# Altium project BusinessCardPCB.PrjPcb
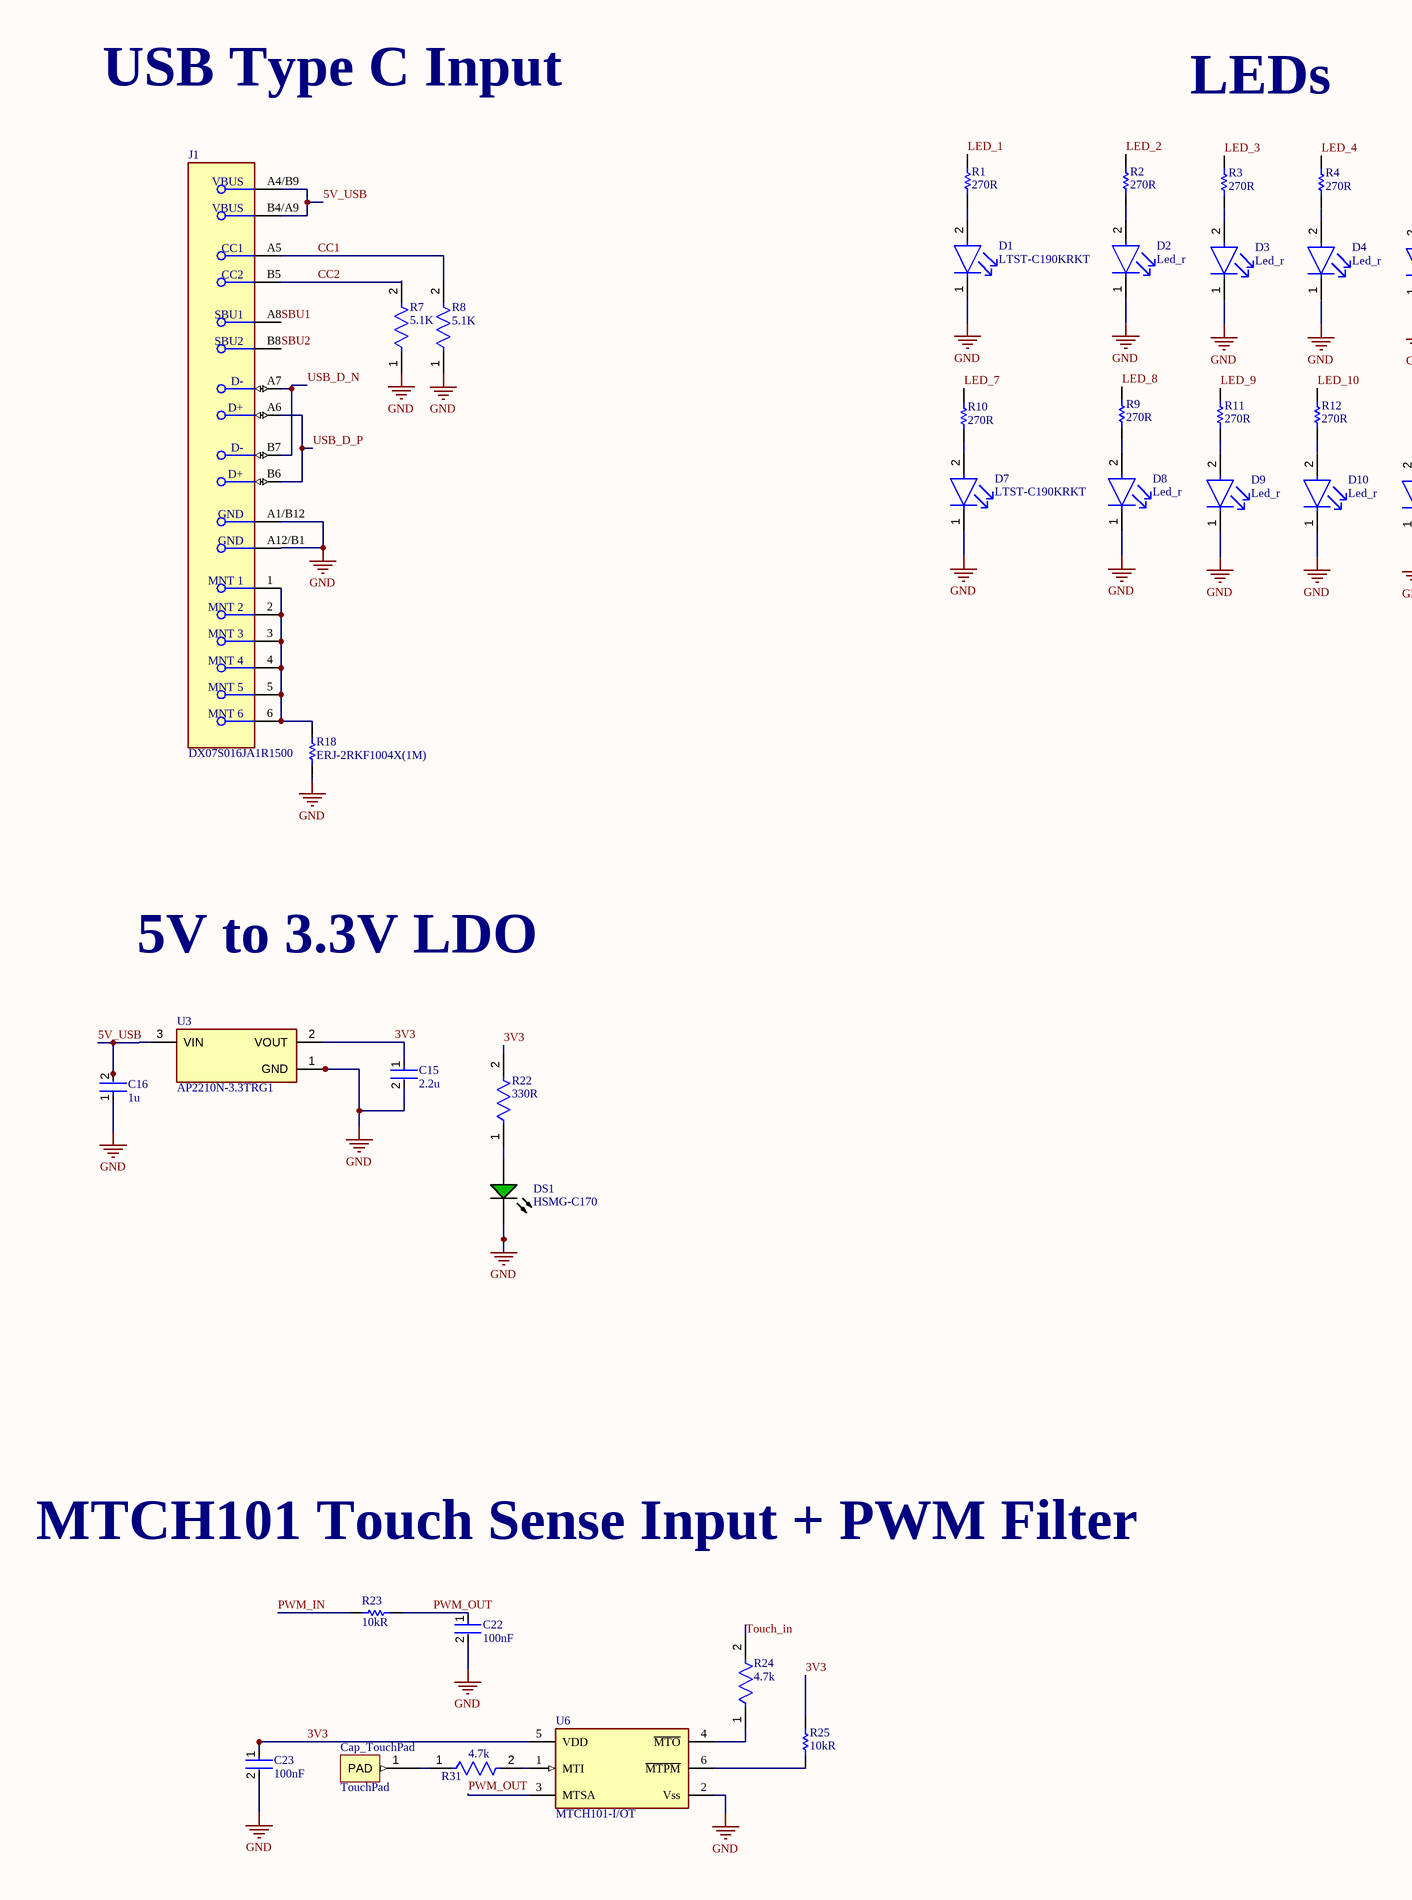
[diagram p0: PCB_Rev1.SchDoc, left]
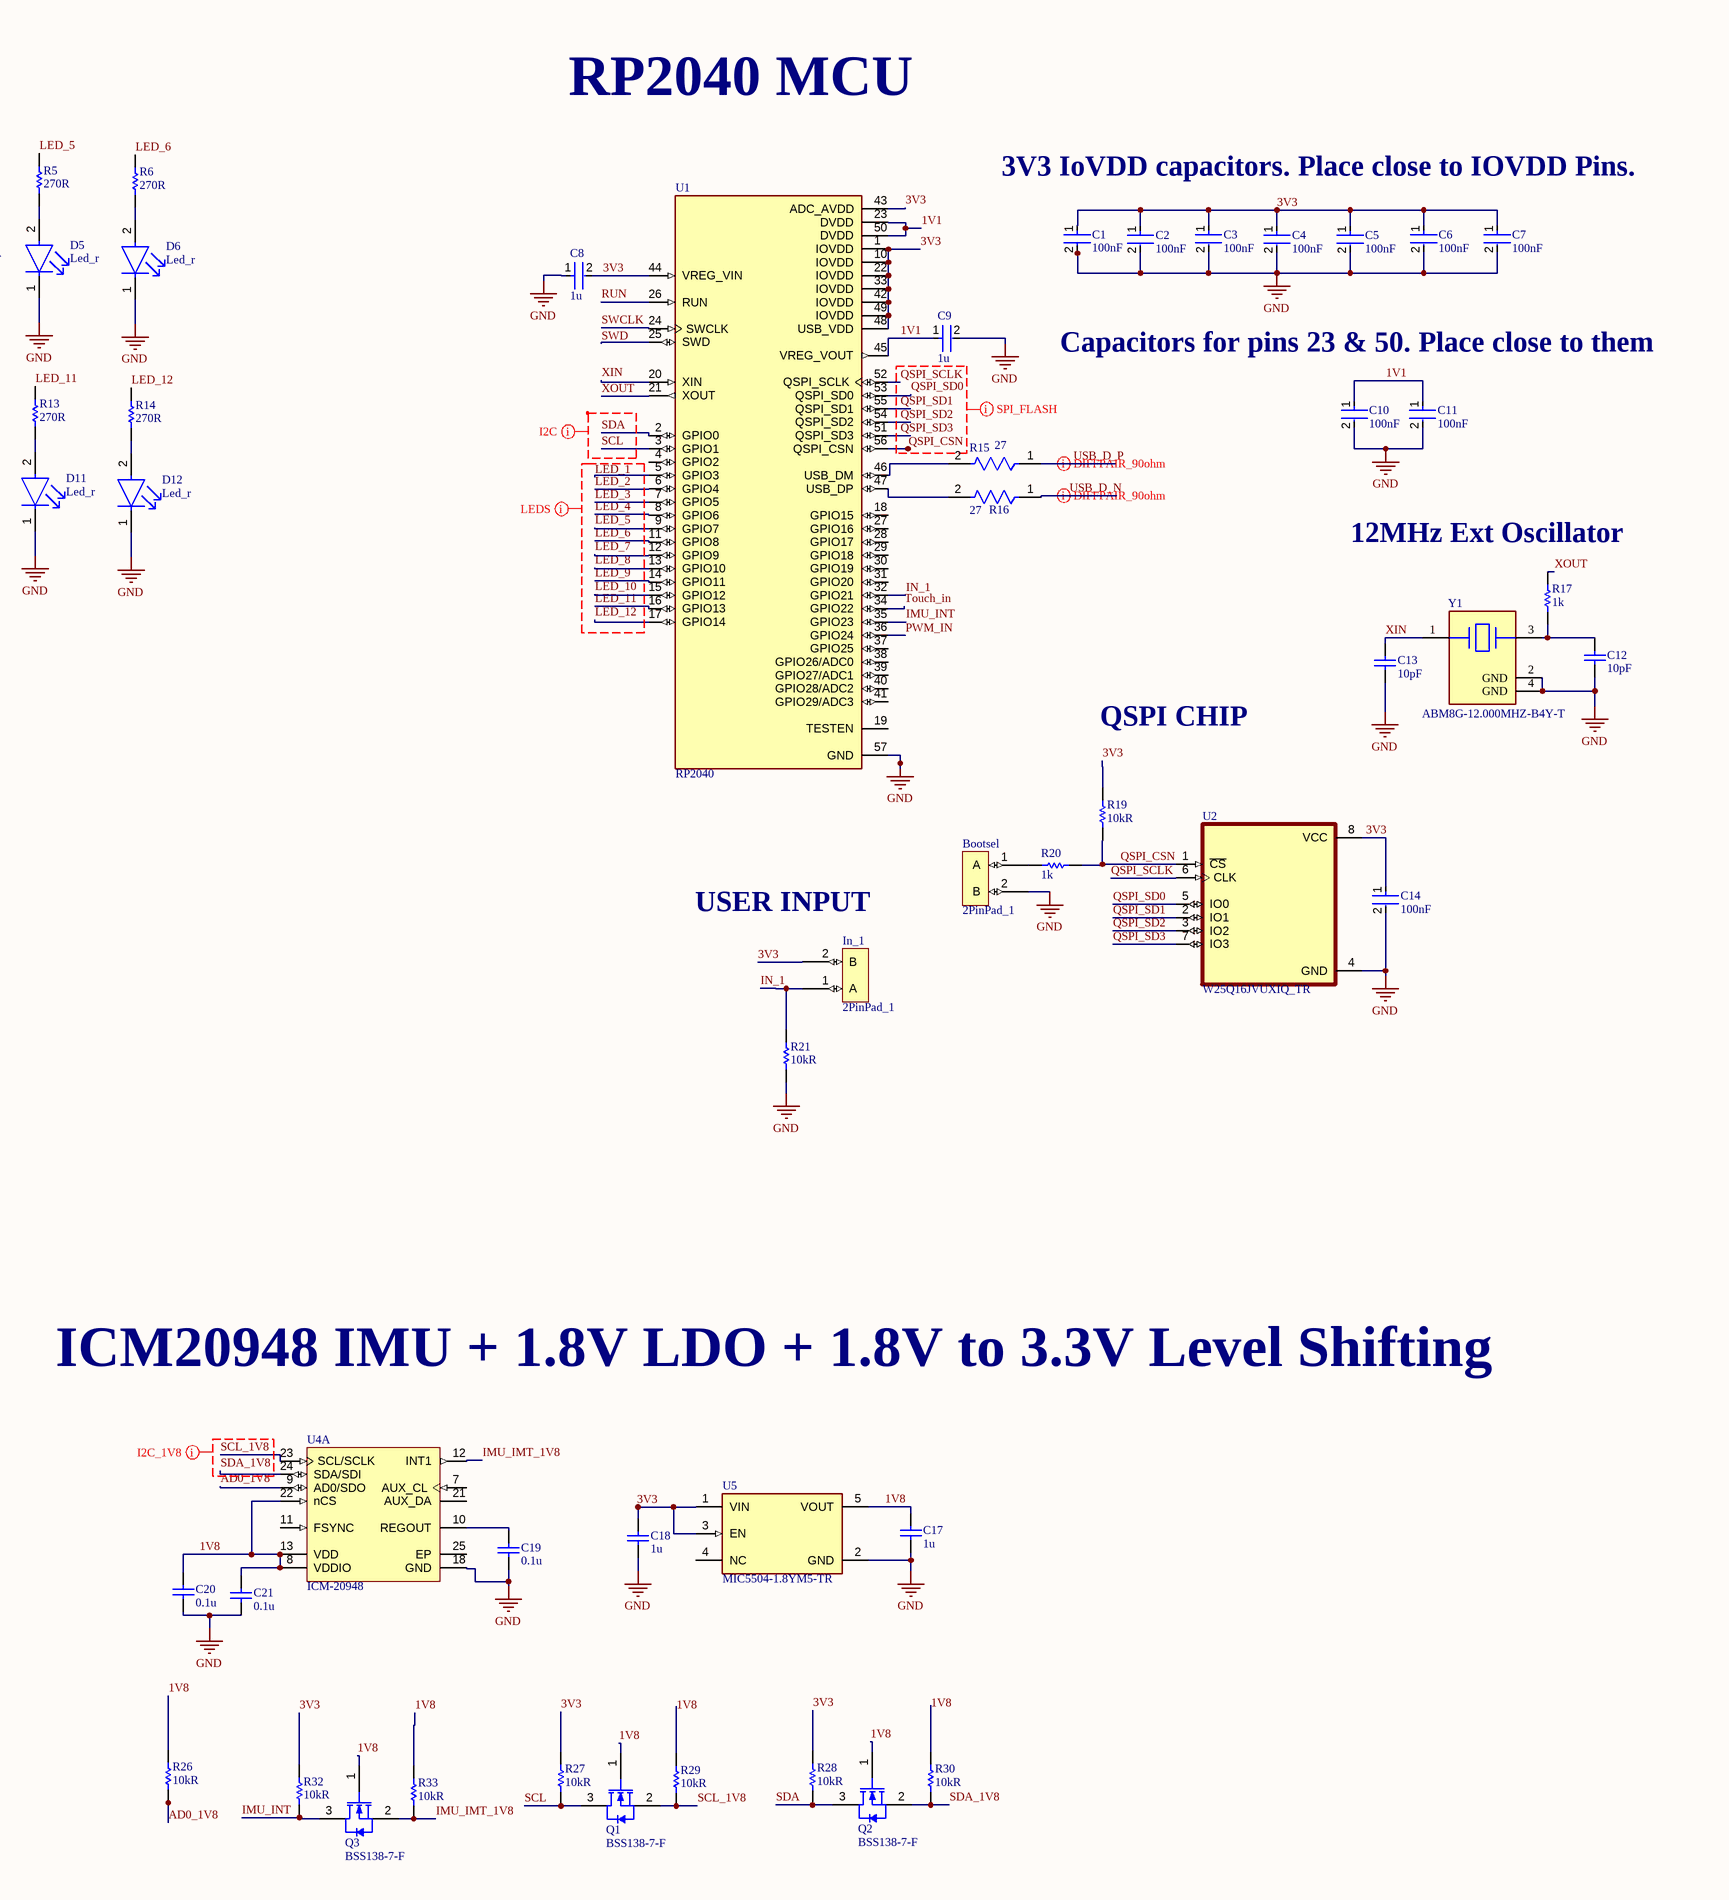
[diagram p1: PCB_Rev1.SchDoc, right]
1 sheet, 83 parts. Net scope: global (net labels, ports and power ports of the same name join across sheets).
Board file: PCB_Rev1.PcbDoc

## Sheet PCB_Rev1.SchDoc: PCB Business Card Schematic
size 594 x 420 mm; Date: June 18th 2023; ApprovedBy: -; CheckedBy: -; Author: Nischay Joshi; CompanyName: -; DrawnBy: Nischay J.; Engineer: -; Organization: -; Revision: 1.0; SheetNumber: 1; SheetTotal: 1; ENG_APP_DATE: -; DSN_APP_DATE: -; CHK_APP_DATE: -; Time: 12:00 pm

### Parts
Bootsel  2PinPad_1  [2PinPad_1]
C1  100nF  [FP-C0402-BB-MFG]
C2  100nF  [FP-C0402-BB-MFG]
C3  100nF  [FP-C0402-BB-MFG]
C4  100nF  [FP-C0402-BB-MFG]
C5  100nF  [FP-C0402-BB-MFG]
C6  100nF  [FP-C0402-BB-MFG]
C7  100nF  [FP-C0402-BB-MFG]
C8  1u  [FP-C0402C105K8PACTU-MFG]
C9  1u  [FP-C0402C105K8PACTU-MFG]
C10  100nF  [FP-C0402-BB-MFG]
C11  100nF  [FP-C0402-BB-MFG]
C12  10pF  [CAPC1005X55X25ML05T05]
C13  10pF  [CAPC1005X55X25ML05T05]
C14  100nF  [FP-C0402-BB-MFG]
C15  2.2u  [FP-C0603C225K4PACTU-MFG]
C16  1u  [FP-C0402C105K8PACTU-MFG]
C17  1u  [CAPC2013X140X50LL20T25]
C18  1u  [CAPC2013X140X50LL20T25]
C19  0.1u  [CAPC1005X55X30NL05T10]
C20  0.1u  [CAPC1005X55X30NL05T10]
C21  0.1u  [CAPC1005X55X30NL05T10]
C22  100nF  [FP-0603-L_1_6_0_15-W_0_81-MFG]
C23  100nF  [FP-C0402-BB-MFG]
Cap_TouchPad  TouchPad  [TouchPad]
D1  LTST-C190KRKT  [FP-LTST-C190KRKT-MFG]
D2  Led_r  [FP-LTST-C190KRKT-MFG]
D3  Led_r  [FP-LTST-C190KRKT-MFG]
D4  Led_r  [FP-LTST-C190KRKT-MFG]
D5  Led_r  [FP-LTST-C190KRKT-MFG]
D6  Led_r  [FP-LTST-C190KRKT-MFG]
D7  LTST-C190KRKT  [FP-LTST-C190KRKT-MFG]
D8  Led_r  [FP-LTST-C190KRKT-MFG]
D9  Led_r  [FP-LTST-C190KRKT-MFG]
D10  Led_r  [FP-LTST-C190KRKT-MFG]
D11  Led_r  [FP-LTST-C190KRKT-MFG]
D12  Led_r  [FP-LTST-C190KRKT-MFG]
DS1  HSMG-C170  [AVAG-HSMX-C170_V]
In_1  2PinPad_1  [2PinPad_1]
J1  DX07S016JA1R1500  [FP-DX07S016JA1R1500-MFG]
Q1  BSS138-7-F  [DIOD-SOT23-3_V]
Q2  BSS138-7-F  [DIOD-SOT23-3_V]
Q3  BSS138-7-F  [DIOD-SOT23-3_V]
R1  270R  [RESC1005X40X25NL05T05]
R2  270R  [RESC1005X40X25NL05T05]
R3  270R  [RESC1005X40X25NL05T05]
R4  270R  [RESC1005X40X25NL05T05]
R5  270R  [RESC1005X40X25NL05T05]
R6  270R  [RESC1005X40X25NL05T05]
R7  5.1K  [FP-CRCW0603-e3-IPC_C]
R8  5.1K  [FP-CRCW0603-e3-IPC_C]
R9  270R  [RESC1005X40X25NL05T05]
R10  270R  [RESC1005X40X25NL05T05]
R11  270R  [RESC1005X40X25NL05T05]
R12  270R  [RESC1005X40X25NL05T05]
R13  270R  [RESC1005X40X25NL05T05]
R14  270R  [RESC1005X40X25NL05T05]
R15  27  [FP-ERJ2R-IPC_B]
R16  27  [FP-ERJ2R-IPC_B]
R17  1k  [RESC1005X40X25NL05T05]
R18  ERJ-2RKF1004X(1M)  [RESC1005X40X25LL05T05]
R19  10kR  [RESC1005X40X25ML05T10]
R20  1k  [RESC1005X40X25NL05T05]
R21  10kR  [RESC1005X40X25ML05T10]
R22  330R  [FP-RC1005-IPC_B]
R23  10kR  [RESC1005X40X25ML05T10]
R24  4.7k  [FP-AC0402-MFG]
R25  10kR  [RESC1005X40X25ML05T10]
R26  10kR  [RESC1005X40X25ML05T10]
R27  10kR  [RESC1005X40X25ML05T10]
R28  10kR  [RESC1005X40X25ML05T10]
R29  10kR  [RESC1005X40X25ML05T10]
R30  10kR  [RESC1005X40X25ML05T10]
R31  4.7k  [FP-AC0402-MFG]
R32  10kR  [RESC1005X40X25ML05T10]
R33  10kR  [RESC1005X40X25ML05T10]
U1  RP2040  [QFN40P700X700X90-57N]
U2  W25Q16JVUXIQ_TR  [PSON50P300X200X60-9N]
U3  AP2210N-3.3TRG1  [FP-SOT23-IPC_C]
U4  ICM-20948  [TDK-QFN-24_L]  (part A of 2)
U5  MIC5504-1.8YM5-TR  [FP-SOT23-5LD-PL-1-MFG]
U6  MTCH101-I/OT  [FP-C04-028-MFG]
Y1  ABM8G-12.000MHZ-B4Y-T  [FP-ABM8G-MFG]

### Nets
GND: Bootsel.2(B) C1.2 C2.2 C3.2 C4.2 C5.2 C6.2 C7.2 C8.1 C9.2 C10.2 C11.2 C12.1 C13.1 C14.2 C15.2 C16.1 C17.2 C18.2 C19.1 C20.1 C21.1 C22.2 C23.2 D1.1(C) D2.1(C) D3.1(C) D4.1(C) D5.1(C) D6.1(C) D7.1(C) D8.1(C) D9.1(C) D10.1(C) D11.1(C) D12.1(C) DS1.2(K) R7.1 R8.1 R18.1 R21.1 U1.57(GND) U2.4(GND) U3.1(GND) U4.18(GND) U5.2(GND) U6.2(Vss) Y1.2(GND) Y1.4(GND)
1V1: C9.1 C10.1 C11.1 U1.23(DVDD) U1.45(VREG_VOUT) U1.50(DVDD)
1V8: C17.1 C20.2 C21.2 Q1.1(G) Q2.1(G) Q3.1(G) R26.2 R29.2 R30.2 R33.2 U4.8(VDDIO) U4.13(VDD) U4.22(nCS) U5.5(VOUT)
3V3: C1.1 C2.1 C3.1 C4.1 C5.1 C6.1 C7.1 C8.2 C14.1 C15.1 C18.1 C23.1 In_1.2(B) R19.2 R22.2 R25.2 R27.2 R28.2 R32.2 U1.1(IOVDD) U1.10(IOVDD) U1.22(IOVDD) U1.33(IOVDD) U1.42(IOVDD) U1.43(ADC_AVDD) U1.44(VREG_VIN) U1.48(USB_VDD) U1.49(IOVDD) U2.8(VCC) U3.2(VOUT) U5.1(VIN) U5.3(EN) U6.5(VDD)
5V_USB: C16.2 J1.A4/B9(VBUS) J1.B4/A9(VBUS) U3.3(VIN)
AD0_1V8: R26.1 U4.9(AD0/SDO)
CC1: J1.A5(CC1) R8.2
CC2: J1.B5(CC2) R7.2
IMU_IMT_1V8: Q3.2(S) R33.1 U4.12(INT1)
IMU_INT: Q3.3(D) R32.1 U1.35(GPIO23)
IN_1: In_1.1(A) R21.2 U1.32(GPIO21)
LED_1: R1.2 U1.5(GPIO3)
LED_2: R2.2 U1.6(GPIO4)
LED_3: R3.2 U1.7(GPIO5)
LED_4: R4.2 U1.8(GPIO6)
LED_5: R5.2 U1.9(GPIO7)
LED_6: R6.2 U1.11(GPIO8)
LED_7: R10.2 U1.12(GPIO9)
LED_8: R9.2 U1.13(GPIO10)
LED_9: R11.2 U1.14(GPIO11)
LED_10: R12.2 U1.15(GPIO12)
LED_11: R13.2 U1.16(GPIO13)
LED_12: R14.2 U1.17(GPIO14)
PWM_IN: R23.2 U1.36(GPIO24)
PWM_OUT: C22.1 R23.1 U6.3(MTSA)
QSPI_CSN: R19.1 R20.1 U1.56(QSPI_CSN) U2.1(~{CS})
QSPI_SCLK: U1.52(QSPI_SCLK) U2.6(CLK)
QSPI_SD0: U1.53(QSPI_SD0) U2.5(IO0)
QSPI_SD1: U1.55(QSPI_SD1) U2.2(IO1)
QSPI_SD2: U1.54(QSPI_SD2) U2.3(IO2)
QSPI_SD3: U1.51(QSPI_SD3) U2.7(IO3)
RUN: U1.26(RUN)
SBU1: J1.A8(SBU1)
SBU2: J1.B8(SBU2)
SCL: Q1.3(D) R27.1 U1.3(GPIO1)
SCL_1V8: Q1.2(S) R29.1 U4.23(SCL/SCLK)
SDA: Q2.3(D) R28.1 U1.2(GPIO0)
SDA_1V8: Q2.2(S) R30.1 U4.24(SDA/SDI)
SWCLK: U1.24(SWCLK)
SWD: U1.25(SWD)
Touch_in: R24.2 U1.34(GPIO22)
USB_D_N: J1.A7(D-) J1.B7(D-) R16.1
USB_D_P: J1.A6(D+) J1.B6(D+) R15.1
XIN: C13.2 U1.20(XIN) Y1.1
XOUT: R17.2 U1.21(XOUT)
NetBootsel_1: Bootsel.1(A) R20.2
NetC12_2: C12.2 R17.1 Y1.3
NetC19_2: C19.2 U4.10(REGOUT)
NetCap_TouchPad_1: Cap_TouchPad.1(PAD) R31.1
NetD1_2: D1.2(A) R1.1
NetD2_2: D2.2(A) R2.1
NetD3_2: D3.2(A) R3.1
NetD4_2: D4.2(A) R4.1
NetD5_2: D5.2(A) R5.1
NetD6_2: D6.2(A) R6.1
NetD7_2: D7.2(A) R10.1
NetD8_2: D8.2(A) R9.1
NetD9_2: D9.2(A) R11.1
NetD10_2: D10.2(A) R12.1
NetD11_2: D11.2(A) R13.1
NetD12_2: D12.2(A) R14.1
NetDS1_1: DS1.1(A) R22.1
NetJ1_1: J1.1(MNT_1) J1.2(MNT_2) J1.3(MNT_3) J1.4(MNT_4) J1.5(MNT_5) J1.6(MNT_6) R18.2
NetR15_2: R15.2 U1.46(USB_DM)
NetR16_2: R16.2 U1.47(USB_DP)
NetR24_1: R24.1 U6.4(~{MTO})
NetR25_1: R25.1 U6.6(~{MTPM})
NetR31_2: R31.2 U6.1(MTI)

Not connected (* = marked no-connect by the designer): J1 A1/B12(GND) A12/B1(GND); U1 4(GPIO2) 18(GPIO15) 19(TESTEN) 27(GPIO16) 28(GPIO17) 29(GPIO18) 30(GPIO19) 31(GPIO20) 37(GPIO25) 38(GPIO26/ADC0) 39(GPIO27/ADC1) 40(GPIO28/ADC2) 41(GPIO29/ADC3); U4 7(AUX_CL) 11(FSYNC) 21(AUX_DA) 25(EP); U5 4(NC)

### Layout directives
differential pair; differential pair class 90ohm; net class USB: USB_D_N, USB_D_P
net class SPI_FLASH: QSPI_CSN, QSPI_SCLK, QSPI_SD0, QSPI_SD1, QSPI_SD2, QSPI_SD3
net class I2C: SCL, SDA
net class LEDS: LED_1, LED_2, LED_3, LED_4, LED_5, LED_6, LED_7, LED_8, LED_9, LED_10, LED_11, LED_12
net class I2C_1V8: SCL_1V8, SDA_1V8

### Notes on the sheet
- USB Type C Input
- LEDs
- RP2040 MCU
- 3V3 IoVDD capacitors. Place close to IOVDD Pins.
- Capacitors for pins 23 & 50. Place close to them
- (near R17) 12MHz Ext Oscillator
- QSPI CHIP
- 5V to 3.3V LDO
- (near In_1) USER INPUT
- ICM20948 IMU + 1.8V LDO + 1.8V to 3.3V Level Shifting
- MTCH101 Touch Sense Input + PWM Filter
- DWG NO:
- REV:
- THIS DOCUMENT AND THE DATA DISCLOSED HEREIN OR
- HEREWITH IS THE PROPERTY OF ALTIUM LIMITED AND MAY
- BE FREELY DISTRIBUTED IN WHOLE. NO RIGHTS ARE
- RESERVED OR EXPRESS OR IMPLIED WARANTEE GIVEN.
- REVISION
- DESCRIPTION
- DATE
- APPROVED
- ENG:
- APPROVALS
- PROJECT
- DSN:
- CHK:
- REFERENCE DOCUMENTS
- PROJECT REVISION:
- TITLE
- DOCUMENT REVISION:
- DESIGN ITEM:
- BOM:
- FAB DWG:
- PCB DWG:
- ASSY DWG:
- SCALE:
- A2
- SIZE
- CAGE CODE
- FILE NAME
- DWG NO.
- SHEET
- OF
- REV

### Library data of the parts
C1-C7 C10 C11 C14 C23 = CMP-2008-02108-2: CAP CER 0.1UF 16V X7R 0402; Manufacturer: Kemet; Manufacturer Part Number: C0402C104K4RACTU; Value: 0.10 μF; Tolerance: 0.1; Material: Ceramic; Temperature Coefficient: 15%; Voltage Rating: 16 V; Package: C0402-BB; Automotive: No; Ipc Land Pattern Name: CAPC10050X50; Device Class L3: Ceramic Capacitors; Capacitance: 0.10 μF; Octopart: https://octopart.com/c0402c104k4ractu-kemet-94158; Temperature Characteristic: X7R; Mouser Description: Cap Ceramic 0.1uF 16V X7R 10% SMD 0402 125?C Paper T/R - Tape and Reel (Alt: C0402C104K4RAC TU); ComponentLink2Description: Datasheet; Temperature Range Low: -55°C; RoHS: TRUE; Device Class L1: Passive Components; Temperature Range High: +125°C; Device Class L2: Capacitors; ComponentLink2URL: https://content.kemet.com/datasheets/KEM_C1002_X7R_SMD.pdf; Category: Cap; Height: 0.55mm; Temperature: -55°C to +125°C; Lead Free: Yes; Digikey Description: CAP CER 0.1UF 16V X7R 0402
C8 C9 C16 = CMP-2008-02081-2: CAP CER 1UF 10V X5R 0402; Dielectric Material: Ceramic; Dissipation Factor: 5%; Tolerance: 10%; Number of Pins: 2; Contact Plating: Tin; Min Operating Temperature: -55°C; Termination: SMD/SMT; Lead Free: Lead Free; Construction: Flat; Voltage Rating (DC): 10V; Mount: Surface Mount; Series: C; Thickness: 0.022inch; Width: 0.5mm; Radiation Hardening: No; Capacitance: 1uF; Dielectric: X5R; Height: 0.5mm; Voltage: 10V; Length: 1mm; Depth: 0.5mm; Max Operating Temperature: 85°C; Package Quantity: 1; Packaging: Tape and Reel; RoHS Compliant: Yes; Case Code (Imperial): 0402; Case Code (Metric): 1005; REACH SVHC: No SVHC; Voltage Rating: 10V; Case/Package: 0402
C12 C13 = CMP-2100-03589-1: Chip Capacitor, 10 pF, +/- 5%, 50 V, -55 to 125 degC, 0402 (1005 Metric), RoHS, Tape and Reel; Manufacturer: Yageo; Insulation Resistance: 100GR; Voltage Rating (DC): 50V; Dielectric Material: Ceramic; Temperature Coefficient: 30ppm/degC; Dielectric: C0G; Termination: SMD/SMT; Package Reference: 0402; Lead Free: LeadFree; Composition: Ceramic; Tolerance: 5%; Case Code (Metric): 1005; Voltage Rating: 50V; Packaging: TapeandReel; Manufacturer URL: http://www.yageo.com/; REACH SVHC: NoSVHC; Max Operating Temperature: 125degC; Length: 1mm; Mount: SurfaceMount; Depth: 0.5mm; Min Operating Temperature: -55degC; Number of Pins: 2; Width: 0.02inch; Datasheet Version: Rev. 14, 07/2016; Package Quantity: 1; Datasheet URL: http://www.yageo.com/documents/recent/UPY-GP_NP0_16V-to-50V_14.pdf; Case Code (Imperial): 0402; RoHSCompliant: True; Radiation Hardening: No; Height: 0.5mm; Case/Package: 0402; Thickness: 0.022inch; Capacitance: 10pF; Package Description: 2-Pin Surface Mount Device, Body 1 x 0.5 mm; Voltage: 50V
C15 = CMP-2006-02259-2: CAP CER 2.2UF 16V X5R 0603; Dielectric Material: Ceramic; Tolerance: 10%; Dissipation Factor: 5%; Series: C; Voltage Rating (DC): 16V; REACH SVHC: No SVHC; RoHS Compliant: Yes; Number of Pins: 2; Max Operating Temperature: 85°C; Voltage Rating: 16V; Min Operating Temperature: -55°C; Termination: SMD/SMT; Dielectric: X5R; Packaging: Tape and Reel; Contact Plating: Tin; Case Code (Metric): 1608; Height: 0.8mm; Capacitance: 2.2uF; Case/Package: 0603; Width: 0.8mm; Construction: Flat; Depth: 0.8mm; Thickness: 0.034inch; Radiation Hardening: No; Length: 1.6mm; Mount: Surface Mount; Case Code (Imperial): 0603; Voltage: 16V; Package Quantity: 1; Lead Free: Lead Free
C17 C18 = CMP-1036-04737-2: Manufacturer: Kemet; Part Number: C0805C105J8RACTU
C19-C21 = CMP-2008-03087-1: Manufacturer: Kemet; Part Number: C0402C104K9RACTU
C22 = CMP-2006-02049-2: General Purpose Ceramic Capacitor, 0603, 100nF, 5%, X7R, 15%, 50V; Termination: SMD/SMT; Contact Plating: Tin; Min Operating Temperature: -55°C; Width: 0.032inch; Length: 1.6mm; Case Code (Metric): 1608; REACH SVHC: No SVHC; Thickness: 0.035inch; Voltage Rating: 50V; Packaging: Tape and Reel; Series: -; Number of Pins: 2; Capacitance: 100nF; Dielectric: X7R; RoHS Compliant: Yes; Case Code (Imperial): 0603; Package Quantity: 1; Height: 0.9mm; Depth: 0.81mm; Max Operating Temperature: 125°C; Voltage Rating (DC): 50V; Construction: Flat; Dielectric Material: Ceramic; Lead Free: Lead Free; Mount: Surface Mount; Tolerance: 5%; Case/Package: 0603; Radiation Hardening: No; Voltage: 50V
D1-D12 = CMP-1674-00011-2: LED RED CLEAR CHIP SMD; Reverse Voltage: 5V; Viewing Angle: 130°; Power Rating: 75mW; Test Current: 20mA; Number of Elements: 1; Lens Color: Colorless; Wavelength: 639nm; Dominant Wavelength: 631nm; Lens Style: Diffused; Forward Current: 30mA; Forward Voltage: 2.4V; Luminous Intensity: 54mcd; Color: Red; Case Code (Imperial): 0603; Lens Transparency: Clear; Lead Free: Lead Free; Package Quantity: 1; Packaging: Tape and Reel; Max Operating Temperature: 85°C; Number of Pins: 2; Height: 0.8mm; Case/Package: 0603; Number of LEDs: 1; Width: 0.8mm; Case Code (Metric): 1608; Depth: 0.8mm; Mount: Surface Mount; Radiation Hardening: No; Length: 1.6mm; Illumination Color: Red; Power Dissipation: 75mW; Min Operating Temperature: -55°C
DS1 = CMP-2000-05062-1: Chip LED, Green, 2.2 V, -40 to 85 degC, 2-Pin SMD, Pb-Free, Tape and Reel; Manufacturer: Avago; No. of Pins: 2; Peak Wavelength: 570nm; SVHC: NoSVHC(16-Jun-2014); Dominant Wavelength: 572nm; Forward Current If: 20mA; Viewing Angle: 170deg; Lens Shape: Rectangular; PIV Max: 5V; External Width: 1.25mm; LED Type: Standard; External Depth: 0.8mm; Opto Mounting Orientation: Top; Luminous Intensity: 15mcd; Luminous Intensity Min: 4mcd; Forward Voltage VF Max: 2.6V; External Length / Height: 2mm; Bulb Size: 1.25mmx1.4mm; Light Area Height: 1mm; Voltage Vf Typ: 2.2V; Operating Temperature Max: 85degC; Datasheet Version: Oct-08; MSL: MSL2A-4weeks; Peak Forward Current: 20mA; Package Description: 2-Pin Surface Mount Device, Body 2 x 1.25 mm, Height 0.8 mm; Datasheet URL: https://datasheet.ciiva.com/29280/180495-da-01-en-chip-led-hsmg-c170-gelb-gruen-29280971.pdf; Storage Temperature Min: -40degC; LED Colour: Green; Wavelength Typ: 570nm; Mounting Type: SMD; Forward Current If Max: 20mA; Dominant Wavelength Typ: 572nm; LED Mounting: SMD; Operating Temperature Range: -30degCto+85degC; Operating Temperature Min: -30degC; Manufacturer URL: http://www.avagotech.com/; Packaging: CutTape; Luminous Intensity Typ: 15mcd; Package Reference: HSMX-C170; Storage Temperature Max: 85degC; Opto Case Style: SMD; Forward Voltage: 2.2V
J1 = CMP-19038-000003-1: CONN RCP USB2.0 TYP C 24P SMD RA
Q1-Q3 = CMP-2000-04930-1: N-Channel Enhancement Mode Mosfet, 50 V, 0.2 A, -55 to 150 degC, 3-Pin SOT23, RoHS, Tape and Reel; Manufacturer: Diodes Inc; Brand: DiodesIncorporated; Unit Weight: 0.000282oz; Pd - Power Dissipation: 300mW; Id - Continuous Drain Current: 200mA; Rds On - Drain-Source Resistance: 3.5Ohms; Vgs - Gate-Source Voltage: 20V; Number of Channels: 1Channel; Vds - Drain-Source Breakdown Voltage: 50V; Transistor Type: 1N-Channel; Typical Turn-Off Delay Time: 20ns; Configuration: Single; Mounting Style: SMD/SMT; Height: 1mm; Package Description: 3-Pin Small Outline Transistor, Body 2.9 x 1.3 mm, Pitch 0.96 mm; Datasheet Version: Rev. 20-2, 11/2013; Minimum Operating Temperature: -55C; Package / Case: SOT-23-3; Channel Mode: Enhancement; Product: MOSFETSmallSignal; Packaging: Reel; Maximum Operating Temperature: +150C; Datasheet URL: https://datasheet.ciiva.com/8115/ds30144-8115344.pdf; Product Category: MOSFET; Width: 1.3mm; Technology: Si; Package Reference: SOT23-3; Manufacturer URL: http://www.diodes.com/; Transistor Polarity: N-Channel; Length: 2.9mm; Factory Pack Quantity: 3000; Series: BSS138; RoHS: True; Typical Turn-On Delay Time: 20ns
R1-R6 R9-R14 = CMP-1011-00444-2: Part Number: ERJ2RKF2700X; Manufacturer: Panasonic
R7 R8 = CMP-1012-00590-3: RES Thick Film, 5.1kΩ, 1%, 0.1W, 100ppm/°C, 0603; Power Rating: 100mW; Voltage Rating (DC): 75V; Resistance: 5.1kR; Width: 0.85mm; Depth: 0.85mm; Military Standard: Not; Package Quantity: 5000; Case Code (Metric): 1608; Length: 1.55mm; Weight: 7.1E-05oz; Packaging: Tape and Reel; Temperature Coefficient: 100ppm/°C; Case Code (Imperial): 0603; Lead Free: Lead Free; Radiation Hardening: No; Contact Plating: Tin; Composition: Thick Film; Max Operating Temperature: 155°C; Termination: SMD/SMT; Case/Package: 0603; Min Operating Temperature: -55°C; Tolerance: 1%; Voltage Rating: 75V; Mount: Surface Mount; Height: 0.45mm
R15 R16 = CMP-2002-00830-2: RES SMD 27 OHM 1% 1/10W 0402; Voltage Rating: 50V; Temperature Coefficient: 100ppm/°C; Resistance: 27R; Power Rating: 100mW; Military Standard: Not; Construction: Rectangular; Tolerance: 1%; Features: Automotive AEC-Q200; Length: 1mm; Lead Free: Lead Free; Mount: Surface Mount; Number of Terminations: 2; Radiation Hardening: No; Number of Pins: 2; Width: 0.5mm; Contact Plating: Tin; Voltage Rating (DC): 50V; Resistance Tolerance: 1%; Series: ERJ; Packaging: Tape and Reel; Case/Package: 0402; Technology: THICK FILM; REACH SVHC: No SVHC; Depth: 0.5mm; Resistor Type: Thick Film; Package Quantity: 1; Termination: SMD/SMT; Case Code (Imperial): 0402; Height: 0.35mm; Weight: 2.8E-05oz; Max Operating Temperature: 155°C; Case Code (Metric): 1005; Min Operating Temperature: -55°C; RoHS Compliant: Yes; Max Power Dissipation: 100mW
R17 R20 = CMP-1011-00510-4: Chip Resistor, 1 KOhm, +/- 1%, 100 mW, -55 to 155 degC, 0402 (1005 Metric), RoHS, Tape and Reel; PartNumber: ERJ-2RKF1001X; Manufacturer: Basic Passives; Voltage Rating: 50 V; Case\/Package: 0402; Resistance: 1 KOhm; Power Rating: 100 mW; DatasheetVersion: 04/2015; Radiation Hardening: No; Pins: 2; Height: 0.35 mm; RoHSCompliant: true; Case Code (Imperial): 0402; ComponentLink2Description: Datasheet; ComponentLink1Description: Manufacturer URL; PackageReference: 0402; Mount: Surface Mount; Package Quantity: 10000; Tolerance: 1%; ComponentLink1URL: http://www.panasonic.com/; PackageDescription: 2-Pin Surface Mount Device, Body 1 x 0.5 mm; Mounting Technology: Surface Mount; Case Code (Metric): 1005; ComponentLink2URL: http://industrial.panasonic.com/cdbs/www-data/pdf/RDA0000/AOA0000C86.pdf; REACH SVHC: Yes; Packaging: Tape and Reel; Max Operating Temperature: 155 degC; Min Operating Temperature: -55 degC; Width: 0.5 mm; Length: 1 mm
R18 = CMP-2002-00609-3: Chip Resistor, 1 MOhm, +/- 1%, 100 mW, -55 to 155 degC, 0402 (1005 Metric), RoHS, Tape and Reel; Manufacturer: Basic Passives; Voltage Rating: 50 V; Case\/Package: 0402; Resistance: 1 MOhm; Power Rating: 100 mW; Pins: 2; Max Operating Temperature: 155 degC; ComponentLink2URL: http://industrial.panasonic.com/cdbs/www-data/pdf/RDA0000/AOA0000C86.pdf; Weight: 2.8E-05oz; ComponentLink1URL: http://www.panasonic.com/; Radiation Hardening: No; Height: 0.35 mm; Case Code (Imperial): 0402; ComponentLink2Description: Datasheet; Mount: Surface Mount; ComponentLink1Description: Manufacturer URL; REACH SVHC: Yes; PartNumber: ERJ-2RKF1004X; Length: 1 mm; Min Operating Temperature: -55 degC; Width: 0.5 mm; Package Quantity: 10000; Tolerance: 1%; PackageDescription: 2-Pin Surface Mount Device, Body 1 x 0.5 mm; RoHSCompliant: true; DatasheetVersion: 04/2015; PackageReference: 0402; Mounting Technology: Surface Mount; Case Code (Metric): 1005; Packaging: Tape and Reel
R19 R21 R23 R25-R30 R32 R33 = CMP-2002-03043-1: Part Number: CRCW040210K0FKEDHP; Manufacturer: Vishay Dale
R22 = CMP-13261-004965-1: Res Thick Film 0402 330Ω 1% 0.063W ±100ppm/°C Molded SMD T/R; Max Power Dissipation: 63mW; Contact Plating: Tin; Case/Package: 0402; Width: 0.02inch; Min Operating Temperature: -55°C; Composition: Thick Film; Package Quantity: 1; Length: 0.039inch; Case Code (Imperial): 0402; Case Code (Metric): 1005; Height: 0.016inch; Features: Moisture Resistant; Resistance: 330R; Radiation Hardening: No; Military Standard: Not; Depth: 0.5mm; Temperature Coefficient: 100ppm/°C; Max Operating Temperature: 155°C; Packaging: Tape and Reel; Tolerance: 1%; Number of Terminations: 2; Power Rating: 63mW
R24 R31 = CMP-2002-01824-3: RES 4.7kΩ ±1% 0.063W 0402; Power Rating: 62.5mW; Resistance: 4.7kR; Max Power Dissipation: 63mW; Voltage Rating: 50V; Temperature Coefficient: 100ppm/°C; Max Operating Temperature: 155°C; Tolerance: 1%; Series: AC; Size Code: 0402; Case Code (Metric): 1005; Termination: SMD/SMT; Packaging: Tape and Reel; Min Operating Temperature: -55°C; RoHS Compliant: Yes; Features: Moisture Resistant; Length: 0.039inch; Width: 0.5mm; Weight: 2.3E-05oz; Lead Free: Lead Free; Resistor Type: Thick Film; Case Code (Imperial): 0402; Height: 0.015inch; Case/Package: 0402; Number of Terminations: 2
U1 = RP2040: MF: {'manufacturer': u'Raspberry Pi'}; Package: None; Price: None; Value: *; MP: RP2040; Availability: Unavailable
U2 = W25Q16JVUXIQ_TR: MF: {'manufacturer': u'Winbond'}; MP: W25Q16JVUXIQ TR; Package: None; Price: None; Value: *; Availability: Unavailable
U3 = CMP-12756-000036-1: IC REG LINEAR 3.3V 300MA SOT23-3; Accuracy: 1%; Max Input Voltage: 13.2V; Number of Outputs: 1; Polarity: Positive; Power Supply Rejection Ratio (PSRR): 75dB; Quiescent Current: 150uA; Min Input Voltage: 2.5V; Output Type: Fixed; Dropout Voltage: 250mV; Height: 1.3mm; Weight: 0.000282oz; Packaging: Tape and Reel; Length: 3.02mm; Width: 1.7mm; Max Operating Temperature: 125°C; Output Voltage: 3.3V; Min Operating Temperature: -40°C; Output Current: 300mA; Number of Pins: 3; Number of Regulators: 1; Max Output Current: 300mA; Mount: Surface Mount; Case/Package: SOT-23-3; Package Quantity: 3000
U4 = CMP-2000-07532-1: World’s Lowest Power 9-Axis MEMS MotionTracking(TM) Device, 1.71 to 3.6 V, -40 to 85 degC, 24-Pin QFN, RoHS, Tape and Reel; Manufacturer: TDK; Package Description: 24-Pin Quad Flat No-lead Package, Body 3 x 3 mm, Pitch 0.4 mm; Datasheet Version: Rev. 1.3, 06/2017; Package Reference: QFN-24; Mounting Technology: SurfaceMount; Datasheet URL: https://www.invensense.com/wp-content/uploads/2016/06/DS-000189-ICM-20948-v1.3.pdf; Manufacturer URL: http://www.tdk.com/
U5 = CMP-06324-000021-1: IC REG LINEAR 1.8V 300MA SOT23-5; Manufacturer: Microchip; Dropout Voltage: 160mV; Number Of Outputs: 1; Nominal Supply Current: 38-42uA; Accuracy Percentage: 2%; Max Supply Voltage: 5.5V; Max Junction Temp: +125°C; Min Supply Voltage: 2.5V; Standoff Height: 0mm; Output Type: Fixed; Temperature Range Low: -40°C; Temperature Range High: +125°C; Automotive: No; Octopart: https://octopart.com/mic5504-1.8ym5-tr-microchip-66803399; RoHS: TRUE; Device Class L1: Integrated Circuits (ICs); Device Class L3: Voltage Regulators - Linear; Package: SOT23-5LD-PL-1; Device Class L2: Power Management ICs; Output Current: 300mA; Digikey Description: IC REG LINEAR 1.8V 300MA SOT23-5; Lead Free: Yes; Output Voltage: 1.8V; Height: 1.45mm; Category: IC; ComponentLink2Description: Datasheet; Temperature: -40°C to +125°C; ComponentLink2URL: http://ww1.microchip.com/downloads/en/DeviceDoc/MIC5501-02-03-04-300mA-Single-Output-LDO-in-Small-Packages-DS20006006B.pdf; Manufacturer Part Number: MIC5504-1.8YM5-TR
U6 = CMP-06354-000003-1: IC PROXIMITY DETECTOR SOT23-6; Nominal Supply Current: 120uA; Min Supply Voltage: 2V; Sensing Method: Capacitive; Output Configuration: Digital; Operating Supply Current: 340uA; Max Supply Current: 25mA; Max Supply Voltage: 5.5V; Number of Pins: 6; Packaging: Bulk; Package Quantity: 3000; Min Operating Temperature: -40°C; Width: 1.8mm; Mount: Surface Mount; Max Operating Temperature: 85°C; Supply Current: 120uA; REACH SVHC: No SVHC; Height: 1.3mm; Length: 3.1mm; Case/Package: SOT-23; Series: -; RoHS Compliant: Yes; Max Output Current: 25mA; Radiation Hardening: No
Y1 = CMP-27762-015546-1: Crystal 12MHz ±30ppm (Tol) ±30ppm (Stability) 10pF FUND 120Ω 4-Pin SMD T/R; ESR (Equivalent Series Resistance): 120R; Height: 1mm; Operating Frequency: 12 MHz; Case/Package: CSMD; Max Operating Temperature: 70°C; Load Capacitance: 10pF; Series: ABM8G; Depth: 2.5mm; Package Quantity: 1000; Frequency: 12MHz; Min Operating Temperature: -20°C; Length: 3.2mm; Termination: SMD/SMT; Frequency Tolerance: 30ppm; Frequency Stability: 30ppm; Tolerance: 30ppm; Lead Free: Lead Free; Number of Pins: 4; Mount: Surface Mount; Width: 2.5mm; Packaging: Tape and Reel